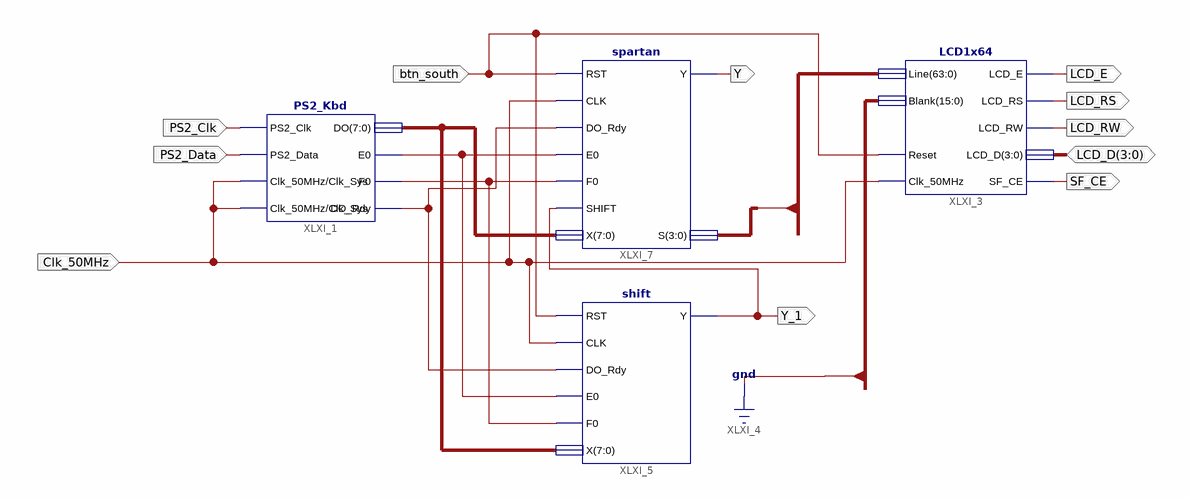
[diagram p0: schematic sheet 1]
// Xilinx ISE schematic spartansch.sch (spartan3e) as structural Verilog: 4 symbols, 11 ports
module spartansch (
  input  PS2_Clk,
  input  PS2_Data,
  input  Clk_50MHz,
  input  btn_south,
  inout  [3:0] LCD_D,
  output Y,
  output LCD_E,
  output LCD_RS,
  output LCD_RW,
  output SF_CE,
  output Y_1
);

  wire XLXN_7, XLXN_21, XLXN_22;
  wire [7:0] XLXN_4;
  wire [15:1] Blank;
  wire [63:0] Line;

  PS2_Kbd XLXI_1 (
    .PS2_Clk(PS2_Clk), .PS2_Data(PS2_Data), .Clk_50MHz(Clk_50MHz), .E0(XLXN_21), .F0(XLXN_22),
    .DO_Rdy(XLXN_7), .DO(XLXN_4), .Clk_Sys(Clk_50MHz));
  LCD1x64 XLXI_3 (
    .Clk_50MHz(Clk_50MHz), .Reset(btn_south), .Line(Line), .Blank({Blank, 1'b0}), .LCD_D(LCD_D),
    .LCD_E(LCD_E), .LCD_RW(LCD_RW), .LCD_RS(LCD_RS), .SF_CE(SF_CE));
  shift XLXI_5 (.RST(btn_south), .CLK(Clk_50MHz), .DO_Rdy(XLXN_7), .E0(XLXN_21), .F0(XLXN_22), .X(XLXN_4), .Y(Y_1));
  spartan XLXI_7 (
    .RST(btn_south), .CLK(Clk_50MHz), .DO_Rdy(XLXN_7), .E0(XLXN_21), .F0(XLXN_22), .SHIFT(Y_1), .X(XLXN_4),
    .Y(Y), .S(Line[3:0]));
endmodule
